# Altium schematic sheet OUT.SCHDOC
size 508 x 241 mm
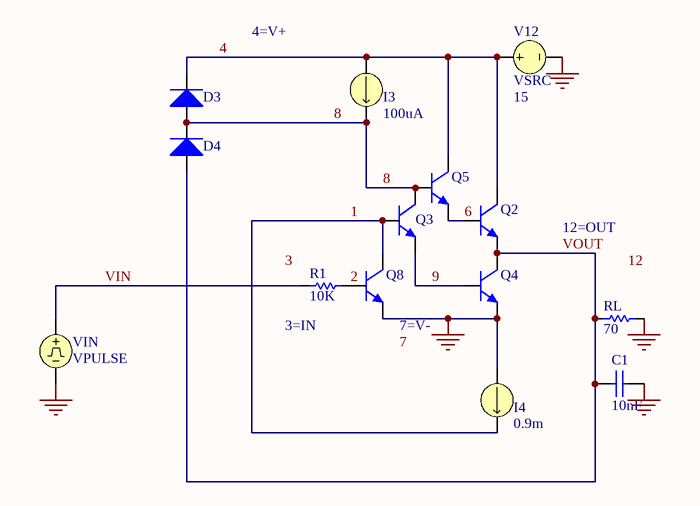
[diagram p0: OUT.SCHDOC]

## Parts
C1  value 10nF  [0805]  (hidden comment: Cap)
D3  Diode  [diode400]  (value not drawn)
D4  Diode  [diode400]  (value not drawn)
I3  value 100uA  (hidden comment: ISRC)
I4  value 0.9m  (hidden comment: ISRC)
Q2  NPN  [SOT23]  (value not drawn)
Q3  NPN  [SOT23]  (value not drawn)
Q4  NPN  [SOT23]  (value not drawn)
Q5  NPN  [SOT23]  (value not drawn)
Q8  NPN  [SOT23]  (value not drawn)
R1  value 10K  [0805]  (hidden comment: Res)
RL  value 70  [0805]  (hidden comment: Res)
V12  VSRC  value 15
VIN  VPULSE

## Nets
GND: C1.1 I4.1 Q4.3(E) Q8.3(E) RL.2 V12.2 VIN.2
1: I4.2 Q3.2(B) Q8.1(C)
2: Q8.2(B) R1.1
4: D3.2 I3.1 Q2.1(C) Q5.1(C) V12.1
6: Q2.2(B) Q5.3(E)
8: D3.1 D4.2 I3.2 Q3.1(C) Q5.2(B)
9: Q3.3(E) Q4.2(B)
VIN: R1.2 VIN.1
VOUT: C1.2 D4.1 Q2.3(E) Q4.1(C) RL.1

## Notes on the sheet
- 4=V+
- 12=OUT
- (near R1) 3=IN
- (near Q8) 7=V-
- Labels drawn without touching a wire or pin: 3, 7, 12

## Library data of the parts
C1 = Cap: Capacitor; Voltage: 50V; Price: 0.25; Technology: Ceramic
D3 D4 = Diode: Diodo; Price: ?
I3 I4 = ISRC: Current Source; Note: PCB Footprint - Not required; Published: 8-Jun-2000; Revision: 17-Jul-2002: Re-released for DXP Platform.; Package Reference: Not Applicable; Publisher: Altium Limited
Q2-Q5 Q8 = NPN: NPN Bipolar Transistor; pin to pad: 1>3 2>1 3>2; Price: 0.38
R1 RL = Res: Resistor; Power: 0.25W; Price: 0.036
V12 = VSRC: Voltage Source; Note: PCB Footprint - Not required; Published: 8-Jun-2000; Revision: 17-Jul-2002: Re-released for DXP Platform.; Package Reference: Not Applicable; Publisher: Altium Limited
VIN = VPULSE: Pulse Voltage Source; Note: PCB Footprint - Not required; Published: 8-Jun-2000; Revision: 17-Jul-2002: Re-released for DXP Platform.; Package Reference: Not Applicable; Publisher: Altium Limited